# Altium schematic sheet Sheet1.SchDoc
size A3
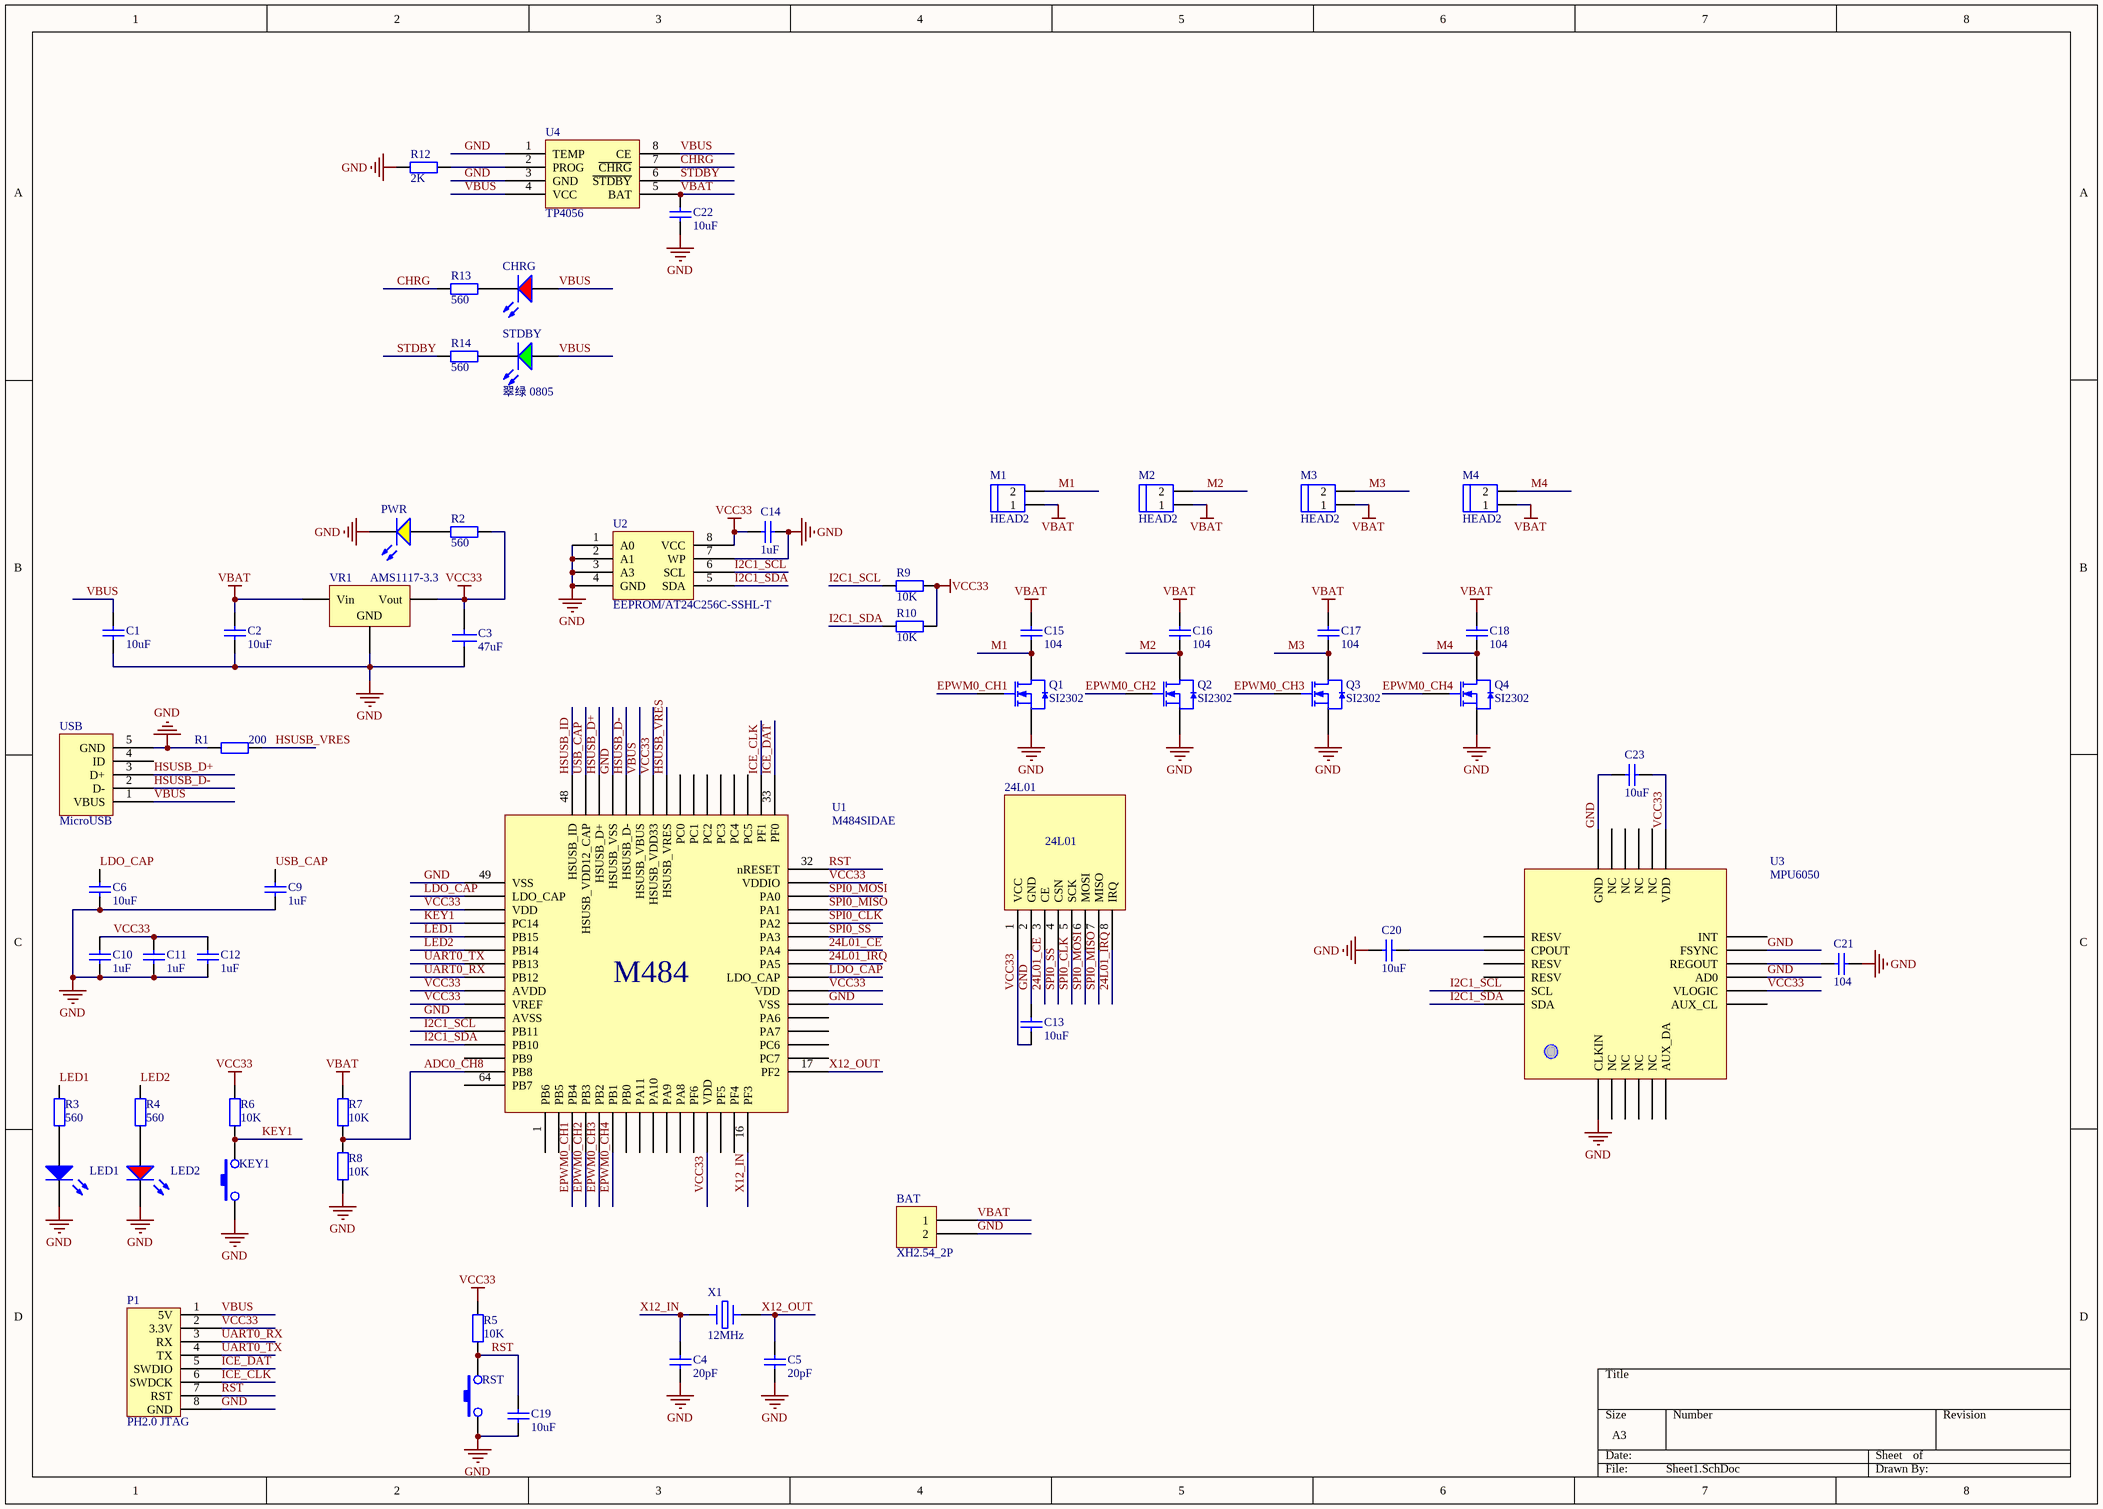
[diagram p0: Sheet1.SchDoc]

## Parts
24L01  (no value)  [NRF24L01]
BAT  XH2.54_2P  [XH_2P]
C1  10uF  [LC-0805_C]
C2  10uF  [LC-0805_C]
C3  47uF  [1206]
C4  20pF  [LC-0603_C]
C5  20pF  [LC-0603_C]
C6  10uF  [LC-0805_C]
C9  1uF  [LC-0805_C]
C10  1uF  [LC-0805_C]
C11  1uF  [LC-0805_C]
C12  1uF  [LC-0805_C]
C13  10uF  [LC-0805_C]
C14  1uF  [LC-0805_C]
C15  104  [LC-0603_C]
C16  104  [LC-0603_C]
C17  104  [LC-0603_C]
C18  104  [LC-0603_C]
C19  10uF  [LC-0805_C]
C20  10uF  [LC-0805_C]
C21  104  [LC-0603_C]
C22  10uF  [LC-0805_C]
C23  10uF  [LC-0805_C]
CHRG  (no value)  [LC-0805_LED_S1]
KEY1  (no value)  [KEY2]
LED1  (no value)  [LC-0805_LED_S1]
LED2  (no value)  [LC-0805_LED_S1]
M1  HEAD2  [HEADER2-1.25MM]
M2  HEAD2  [HEADER2-1.25MM]
M3  HEAD2  [HEADER2-1.25MM]
M4  HEAD2  [HEADER2-1.25MM]
P1  PH2.0 JTAG  [PH2.0 8P]
PWR  (no value)  [LC-0805_LED_S1]
Q1  SI2302  [LC-SOT-23(SOT-23-3)]
Q2  SI2302  [LC-SOT-23(SOT-23-3)]
Q3  SI2302  [LC-SOT-23(SOT-23-3)]
Q4  SI2302  [LC-SOT-23(SOT-23-3)]
R1  200  [LC-0603_R]
R2  560  [LC-0603_R]
R3  560  [LC-0603_R]
R4  560  [LC-0603_R]
R5  10K  [LC-0603_R]
R6  10K  [LC-0603_R]
R7  10K  [LC-0603_R]
R8  10K  [LC-0603_R]
R9  10K  [LC-0603_R]
R10  10K  [LC-0603_R]
R12  2K  [LC-0603_R]
R13  560  [LC-0603_R]
R14  560  [LC-0603_R]
RST  (no value)  [KEY2]
STDBY  翠绿 0805  [LC-0805_LED_S1]
U1  M484SIDAE  [LQFP64L]
U2  EEPROM/AT24C256C-SSHL-T  [LC-SOIC-8_150mil]
U3  MPU6050  [QFN-24_4x4x05P]
U4  TP4056  [LC-SOP-8_EP_150mil]
USB  MicroUSB  [MICROUSB1]
VR1  AMS1117-3.3  [LC-SOT-223]
X1  12MHz  [XTAL1]

## Nets
GND: 24L01.2(GND) BAT.2 C1.1 C2.1 C3.1 C4.1 C5.1 C6.1 C9.1 C10.1 C11.1 C12.1 C13.2 C14.1 C19.1 C20.2 C21.1 C22.1 C23.2 KEY1.1 LED1.K LED2.K P1.8(GND) PWR.K Q1.2(S) Q2.2(S) Q3.2(S) Q4.2(S) R1.1 R8.1 R12.1 RST.1 U1.22(VSS) U1.45(HSUSB_VSS) U1.49(VSS) U1.59(AVSS) U2.1(A0) U2.2(A1) U2.3(A3) U2.4(GND) U2.7(WP) U3.1(CLKIN) U3.9(AD0) U3.11(FSYNC) U3.18(GND) U4.1(TEMP) U4.3(GND) USB.5(GND) VR1.1(GND)
VBAT: BAT.1 C2.2 C15.2 C16.2 C17.2 C18.2 C22.2 M1.1 M2.1 M3.1 M4.1 R7.2 U4.5(BAT) VR1.3(Vin)
VCC33: 24L01.1(VCC) C3.2 C10.2 C11.2 C12.2 C13.1 C14.2 C23.1 P1.2(3.3V) R2.2 R5.2 R6.2 R9.2 R10.2 U1.13(VDD) U1.23(VDD) U1.31(VDDIO) U1.42(HSUSB_VDD33) U1.51(VDD) U1.57(AVDD) U1.58(VREF) U2.8(VCC) U3.8(VLOGIC) U3.13(VDD) VR1.2(Vout)
24L01_CE: 24L01.3(CE) U1.26(PA4)
24L01_IRQ: 24L01.8(IRQ) U1.25(PA5)
ADC0_CH8: R7.1 R8.2 U1.63(PB8)
CHRG: R13.1 U4.7(~{CHRG})
EPWM0_CH1: Q1.1(G) U1.3(PB4)
EPWM0_CH2: Q2.1(G) U1.4(PB3)
EPWM0_CH3: Q3.1(G) U1.5(PB2)
EPWM0_CH4: Q4.1(G) U1.6(PB1)
HSUSB_D+: U1.46(HSUSB_D+) USB.3(D+)
HSUSB_D-: U1.44(HSUSB_D-) USB.2(D-)
HSUSB_ID: U1.48(HSUSB_ID)
HSUSB_VRES: R1.2 U1.41(HSUSB_VRES)
I2C1_SCL: R9.1 U1.60(PB11) U2.6(SCL) U3.23(SCL)
I2C1_SDA: R10.1 U1.61(PB10) U2.5(SDA) U3.24(SDA)
ICE_CLK: P1.6(SWDCK) U1.34(PF1)
ICE_DAT: P1.5(SWDIO) U1.33(PF0)
KEY1: KEY1.2 R6.1 U1.52(PC14)
LDO_CAP: C6.2 U1.24(LDO_CAP) U1.50(LDO_CAP)
LED1: R3.2 U1.53(PB15)
LED2: R4.2 U1.54(PB14)
M1: C15.1 M1.2 Q1.3(D)
M2: C16.1 M2.2 Q2.3(D)
M3: C17.1 M3.2 Q3.3(D)
M4: C18.1 M4.2 Q4.3(D)
RST: C19.2 P1.7(RST) R5.1 RST.2 U1.32(nRESET)
SPI0_CLK: 24L01.5(SCK) U1.28(PA2)
SPI0_MISO: 24L01.7(MISO) U1.29(PA1)
SPI0_MOSI: 24L01.6(MOSI) U1.30(PA0)
SPI0_SS: 24L01.4(CSN) U1.27(PA3)
STDBY: R14.1 U4.6(~{STDBY})
UART0_RX: P1.3(RX) U1.56(PB12)
UART0_TX: P1.4(TX) U1.55(PB13)
USB_CAP: C9.2 U1.47(HSUSB_VDD12_CAP)
VBUS: C1.2 CHRG.A P1.1(5V) STDBY.A U1.43(HSUSB_VBUS) U4.4(VCC) U4.8(CE) USB.1(VBUS)
X12_IN: C4.2 U1.16(PF3) X1.1
X12_OUT: C5.2 U1.17(PF2) X1.2
NetC20_1: C20.1 U3.20(CPOUT)
NetC21_2: C21.2 U3.10(REGOUT)
NetCHRG_K: CHRG.K R13.2
NetLED1_A: LED1.A R3.1
NetLED2_A: LED2.A R4.1
NetPWR_A: PWR.A R2.1
NetR12_2: R12.2 U4.2(PROG)
NetR14_2: R14.2 STDBY.K

Not connected (* = marked no-connect by the designer): U1 1(PB6) 2(PB5) 7(PB0) 8(PA11) 9(PA10) 10(PA9) 11(PA8) 12(PF6) 14(PF5) 15(PF4) 18(PC7) 19(PC6) 20(PA7) 21(PA6) 35(PC5) 36(PC4) 37(PC3) 38(PC2) 39(PC1) 40(PC0) 62(PB9) 64(PB7); U3 2(NC) 3(NC) 4(NC) 5(NC) 6(AUX_DA) 7(AUX_CL) 12(INT) 14(NC) 15(NC) 16(NC) 17(NC) 19(RESV) 21(RESV) 22(RESV); USB 4(ID)

## Notes on the sheet
- (in symbol M484SIDAE) M484

## Library data of the parts
24L01 = NRF24L01
C1 C2 C6 C9-C14 C19 C20 C22 C23 = 0805 1.5nF (152) 10% 50V: 贴片电容; ComponentLink1Description: 供应商链接; ComponentLink1URL: http://www.szlcsc.com/product/details_2069.html; Package: 0805; Supplier: LC; SuppliersPartNumber: C1717
C3 = Capacitor
C4 C5 C15-C18 C21 = 0603 6pF (6R0) 0.25pF 50V: 贴片电容; ComponentLink1Description: 供应商链接; ComponentLink1URL: http://www.szlcsc.com/product/details_38453.html; Package: 0603; Supplier: LC; SuppliersPartNumber: C37474
CHRG LED2 = 0805 红灯: 发光二极管; ComponentLink1Description: 供应商链接; ComponentLink1URL: http://www.szlcsc.com/product/details_2668.html; Package: 0805; Supplier: LC; SuppliersPartNumber: C2295
KEY1 RST = KEY
LED1 = 0805 蓝灯: 发光二极管; ComponentLink1Description: 供应商链接; ComponentLink1URL: http://www.szlcsc.com/product/details_2666.html; Package: 0805; Supplier: LC; SuppliersPartNumber: C2293
PWR = 0805 黄灯: 发光二极管; ComponentLink1Description: 供应商链接; ComponentLink1URL: http://www.szlcsc.com/product/details_2669.html; Package: 0805; Supplier: LC; SuppliersPartNumber: C2296
Q1-Q4 = 2N7002 7002: MOS(场效应管); ComponentLink1Description: 供应商链接; ComponentLink1URL: http://www.szlcsc.com/product/details_9040.html; Package: SOT-23(SOT-23-3); Supplier: LC; SuppliersPartNumber: C8545
R1-R10 R12-R14 = 0603 2.4KΩ (2401) 1%: 贴片电阻; ComponentLink1Description: 供应商链接; ComponentLink1URL: http://www.szlcsc.com/product/details_23667.html; Package: 0603; Supplier: LC; SuppliersPartNumber: C22940
STDBY = 0805 翠绿: 发光二极管; ComponentLink1Description: 供应商链接; ComponentLink1URL: http://www.szlcsc.com/product/details_2670.html; Package: 0805; Supplier: LC; SuppliersPartNumber: C2297
U2 = EEPROM/AT24C256C-SSHL-T: EEPROM; ComponentLink1Description: 供应商链接; ComponentLink1URL: http://www.szlcsc.com/product/details_6947.html; Package: SOIC-8_150mil; Supplier: LC; SuppliersPartNumber: C6482
U4 = TP4056: 电池电源管理; ComponentLink1Description: 供应商链接; ComponentLink1URL: http://www.szlcsc.com/product/details_17264.html; Package: SOP-8_EP_150mil; Supplier: LC; SuppliersPartNumber: C16581
VR1 = SOT-223 AMS1117-3.3: 低压差线性稳压(LDO); ComponentLink1Description: 供应商链接; ComponentLink1URL: http://www.szlcsc.com/product/details_6652.html; Package: SOT-223; Supplier: LC; SuppliersPartNumber: C6186
X1 = XTAL